# Altium project RFID_chip_evaluation.PrjPcb
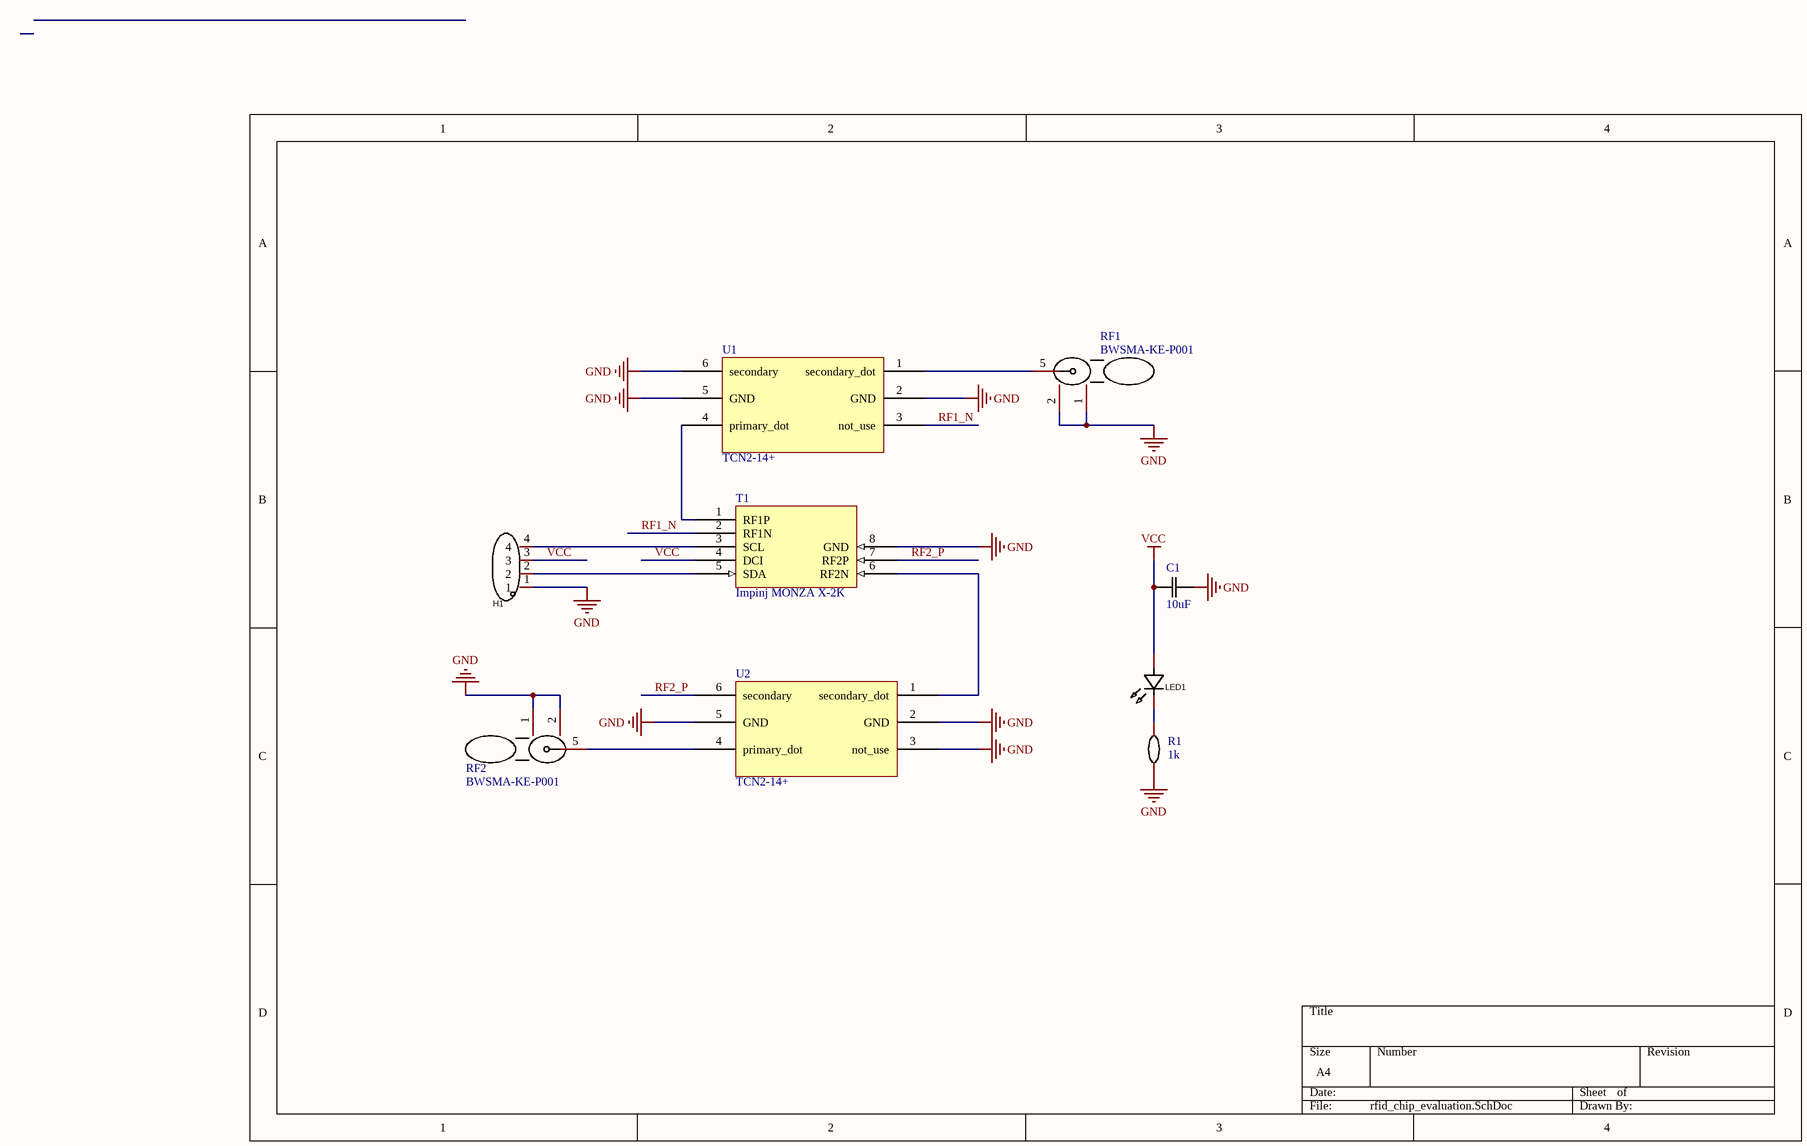
[diagram p0: rfid_chip_evaluation.SchDoc]
1 sheet, 9 parts. Net scope: global (net labels, ports and power ports of the same name join across sheets).
Board file: rfid_chip_evaluation.PcbDoc

## Sheet rfid_chip_evaluation.SchDoc
size A4; SheetNumber: 1; SheetTotal: 1

### Parts
C1  value 10uF  [CAP_CL10_SAM]  (hidden comment: CL10A106KP8NNNC)
H1  PZ254V-11-04P_C492403  [HDR-TH_4P-P2.54-V-M]  (value not drawn)
LED1  XL-1005UGC  [LED0402-RD_GREEN]  (value not drawn)
R1  1k  [R0402]
RF1  BWSMA-KE-P001  [SMA-SMD_BWSMA-KE-P001]
RF2  BWSMA-KE-P001  [SMA-SMD_BWSMA-KE-P001]
T1  Impinj MONZA X-2K  [IPJX2K]
U1  TCN2-14+  [FV1206-1]
U2  TCN2-14+  [FV1206-1]

### Nets
GND: C1.2 H1.1 R1.1 RF1.1 RF1.2 RF2.1 RF2.2 T1.8(GND) U1.2(GND) U1.5(GND) U1.6(secondary) U2.2(GND) U2.3(not_use) U2.5(GND)
VCC: C1.1 H1.3 LED1.2(A) T1.4(DCI)
RF1_N: T1.2(RF1N) U1.3(not_use)
RF2_P: T1.7(RF2P) U2.6(secondary)
NetH1_2: H1.2 T1.5(SDA)
NetH1_4: H1.4 T1.3(SCL)
NetLED1_1: LED1.1(K) R1.2
NetRF1_5: RF1.5 U1.1(secondary_dot)
NetRF2_5: RF2.5 U2.4(primary_dot)
NetT1_1: T1.1(RF1P) U1.4(primary_dot)
NetT1_6: T1.6(RF2N) U2.1(secondary_dot)

### Library data of the parts
C1 = CL10A106KP8NNNC: 10 uF Capacity; Mfr_Name: Samsung; Type: DEV; Copyright: Copyright (C) 2023 Ultra Librarian. All rights reserved.; Manufacturer_Part_Number: CL10A106KP8NNNC; RefDes: RefDes
H1 = PZ254V-11-04P_C492403: Manufacturer: XFCN(兴飞); Add into BOM: yes; Pitch: 2.54mm; Pin Structure: 1x4P; Circluar Pins/Square Pins: 方针; Name: PZ254V-11-04P; Symbol: PZ254V-11-04P; Device: PZ254V-11-04P_C492403; LCSC Part Name: 2.54mm 1x4P 直插 方针; Supplier Part: C492403; Manufacturer Part: PZ254V-11-04P; Supplier Footprint: 直插,P=2.54mm; JLCPCB Part Class: Extended Part; Datasheet: https://atta.szlcsc.com/upload/public/pdf/source/20200309/C492403_F9F19131791D08044AD4F84F8E751A34.pdf; Supplier: LCSC; Convert to PCB: yes; Number of Rows: 单排; Number of Pins: 4; Row Spacing: -; Mounting Type: 直插; Current Rating (Max): -; Voltage Rating (Max): -; Length of Mating Pin: 6mm; Insulation Height: 2.5mm; Length of End Connection Pin: 3mm; Contact Material: 黄铜; Contact Plating: -; Operating Temperature Range: -40℃~+105℃; Color: 黑色
LED1 = XL-1005UGC: 正贴发光二极管 翠绿; Manufacturer: XINGLIGHT(成兴光); Symbol: XL-1005UGC_C2856703; Add into BOM: yes; Lens Color: 无色透明; Dominant Wavelength: 516nm; Peak Wavelength: 531nm; Forward Current: 25mA; Power Dissipation: 80mW; Viewing Angle: 120°; Mounting Sytle: 正贴; Name: XL-1005UGC; Device: XL-1005UGC; LCSC Part Name: 翠绿 516nm 正贴; Supplier Part: C2856703; Manufacturer Part: XL-1005UGC; Supplier Footprint: 0402; JLCPCB Part Class: Extended Part; Datasheet: https://atta.szlcsc.com/upload/public/pdf/source/20221102/FF8D6BC2225363A60A01D46BB802F217.pdf; Supplier: LCSC; Convert to PCB: yes; Emitted Color: 翠绿; Color Temperature: -; Operating Temperature: -30℃~+85℃
R1 = RK73H1ETTP1211F: 电阻类型:厚膜电阻;阻值:1.21kΩ;精度:±1%;功率:100mW;温度系数:±100ppm/℃;最大工作电压:75V;工作温度范围:-55℃~+155℃;; Manufacturer: KOA; Add into BOM: yes; Value: 1.21kΩ; Tolerance: ±1%; Power(Watts): 100mW; Overload Voltage (Max): 75V; Name: 1k; Symbol: RK73H1ETTP1211F; Device: RK73H1ETTP1211F; LCSC Part Name: 1.21kΩ ±1% 100mW; Supplier Part: C171775; Manufacturer Part: RK73H1ETTP1211F; Supplier Footprint: 0402; JLCPCB Part Class: 扩展库; Datasheet: https://atta.szlcsc.com/upload/public/pdf/source/20180126/C171775_15169517954031308606.pdf; Supplier: LCSC; Convert to PCB: yes; Type: 厚膜电阻; Temperature Coefficient: ±100ppm/℃; Operating Temperature Range: -55℃~+155℃
RF1 RF2 = BWSMA-KE-P001: 连接器类型:板端;射频系列:SMA;接口类型:内孔;端口数量:1;阻抗:-;频率-最大值:-;样式:偏脚;接口直径:5.2mm;接口长度/高度:-;工作温度范围:-;; Manufacturer: BAT WIRELESS(蝙蝠无线); Add into BOM: yes; Connector Type: 板端; RF Series: SMA; Interface Type: 内孔; Number of Ports: 1; Style: 偏脚; Interface Diameter: 5.2mm; Symbol: BWSMA-KE-P001; Device: BWSMA-KE-P001; LCSC Part Name: SMA 内孔 偏脚; Supplier Part: C496550; Manufacturer Part: BWSMA-KE-P001; Supplier Footprint: 插件; JLCPCB Part Class: 扩展库; Datasheet: https://atta.szlcsc.com/upload/public/pdf/source/20200416/C496550_06668BF2E3B968EA39F96D17E7156373.pdf; Supplier: LCSC; Convert to PCB: yes; Impedance: -; Frequency-Max: -; Interface Length/Height: -; Operating Temperature Range: -
T1 = Impinj MONZA X-2K: Impinj MONZA X-2K RFID tag chip
U1 U2 = TCN2-14+: balun 700MHz to 1400MHz 1:1